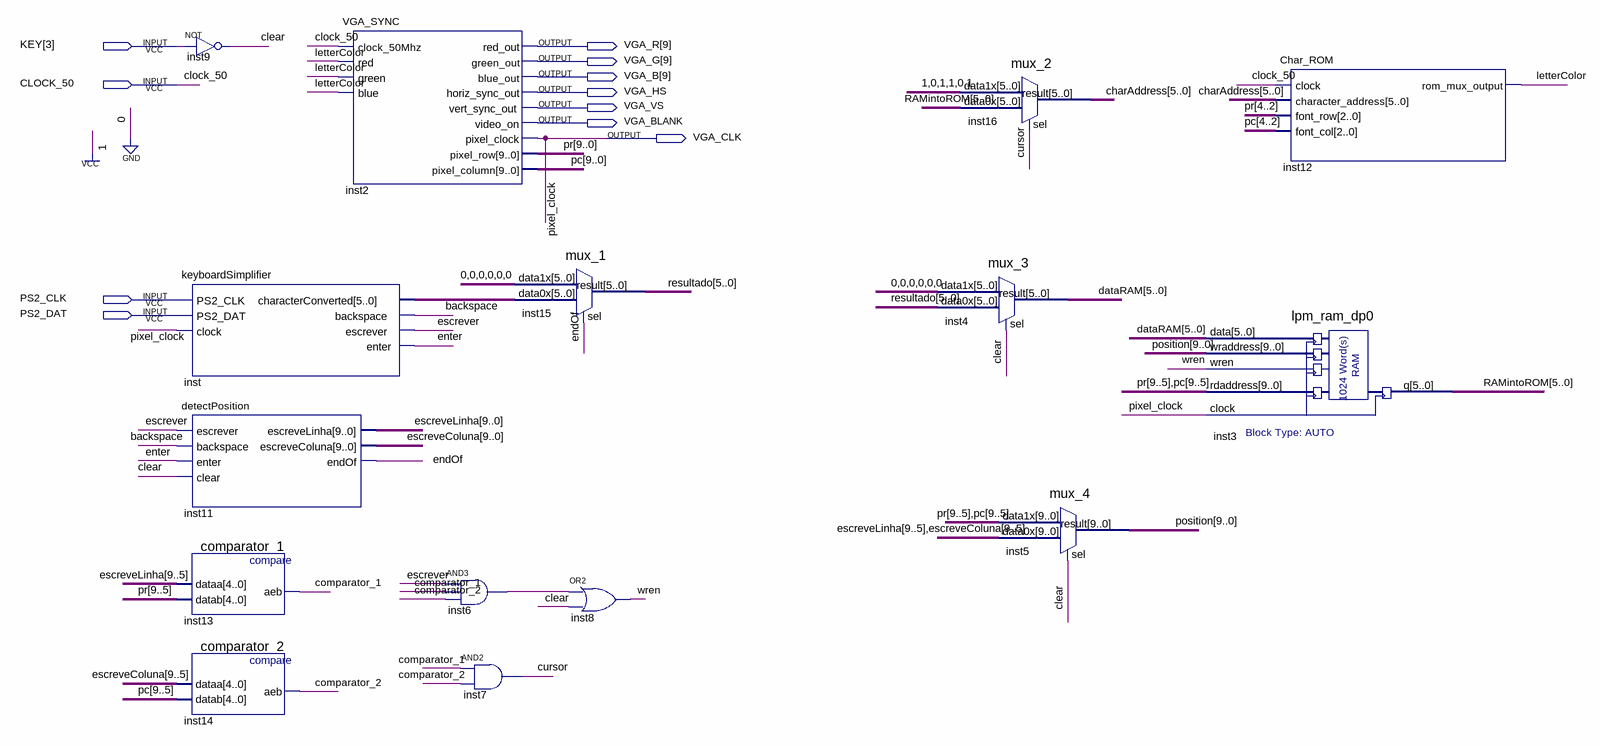
[diagram p0: schematic sheet]
// Quartus schematic editorTexto.bdf as structural Verilog: 15 symbols, 11 pins
module editorTexto (
  input  [3:3] KEY,
  input  CLOCK_50,
  input  PS2_CLK,
  input  PS2_DAT,
  output [9:9] VGA_R,
  output [9:9] VGA_G,
  output [9:9] VGA_B,
  output VGA_HS,
  output VGA_VS,
  output VGA_BLANK,
  output VGA_CLK
);

  wire backspace, clear, comparator_1, comparator_2, cursor, endOf, enter, escrever, inst6_out, letterColor,
       wren;
  wire [5:0] charAddress, dataRAM, inst_characterconverted, RAMintoROM, resultado;
  wire [9:0] escreveColuna, escreveLinha, pc, position, pr;

  keyboardSimplifier inst (
    .PS2_CLK(PS2_CLK), .PS2_DAT(PS2_DAT), .clock(VGA_CLK), .characterConverted(inst_characterconverted),
    .backspace(backspace), .escrever(escrever), .enter(enter));
  detectPosition inst11 (
    .escrever(escrever), .backspace(backspace), .enter(enter), .clear(clear), .escreveLinha(escreveLinha),
    .escreveColuna(escreveColuna), .endOf(endOf));
  comparator_1 inst13 (.dataa(escreveLinha[9:5]), .datab(pr[9:5]), .aeb(comparator_1));
  comparator_2 inst14 (.dataa(escreveColuna[9:5]), .datab(pc[9:5]), .aeb(comparator_2));
  not inst9 (clear, KEY[3]);
  VGA_SYNC inst2 (
    .clock_50Mhz(CLOCK_50), .red(letterColor), .green(letterColor), .blue(letterColor), .red_out(VGA_R[9]),
    .green_out(VGA_G[9]), .blue_out(VGA_B[9]), .horiz_sync_out(VGA_HS), .vert_sync_out(VGA_VS),
    .video_on(VGA_BLANK), .pixel_clock(VGA_CLK), .pixel_row(pr), .pixel_column(pc));
  and inst6 (inst6_out, escrever, comparator_1, comparator_2);
  and inst7 (cursor, comparator_1, comparator_2);
  mux_1 inst15 (.data1x({6{1'b0}}), .data0x(inst_characterconverted), .sel(endOf), .result(resultado));
  or inst8 (wren, inst6_out, clear);
  mux_2 inst16 (.data1x(6'b101101), .data0x(RAMintoROM), .sel(cursor), .result(charAddress));
  mux_3 inst4 (.data1x({6{1'b0}}), .data0x(resultado), .sel(clear), .result(dataRAM));
  mux_4 inst5 (
    .data1x({pr[9:5], pc[9:5]}), .data0x({escreveLinha[9:5], escreveColuna[9:5]}), .sel(clear),
    .result(position));
  lpm_ram_dp0 inst3 (
    .data(dataRAM), .wraddress(position), .wren(wren), .rdaddress({pr[9:5], pc[9:5]}), .clock(VGA_CLK),
    .q(RAMintoROM));
  Char_ROM inst12 (
    .clock(CLOCK_50), .character_address(charAddress), .font_row(pr[4:2]), .font_col(pc[4:2]),
    .rom_mux_output(letterColor));

  // Other names for the same wires on the sheet: pixel_clock = VGA_CLK
endmodule
